# EAGLE design nanoIO-v2.2 (EAGLE 9.6.2)
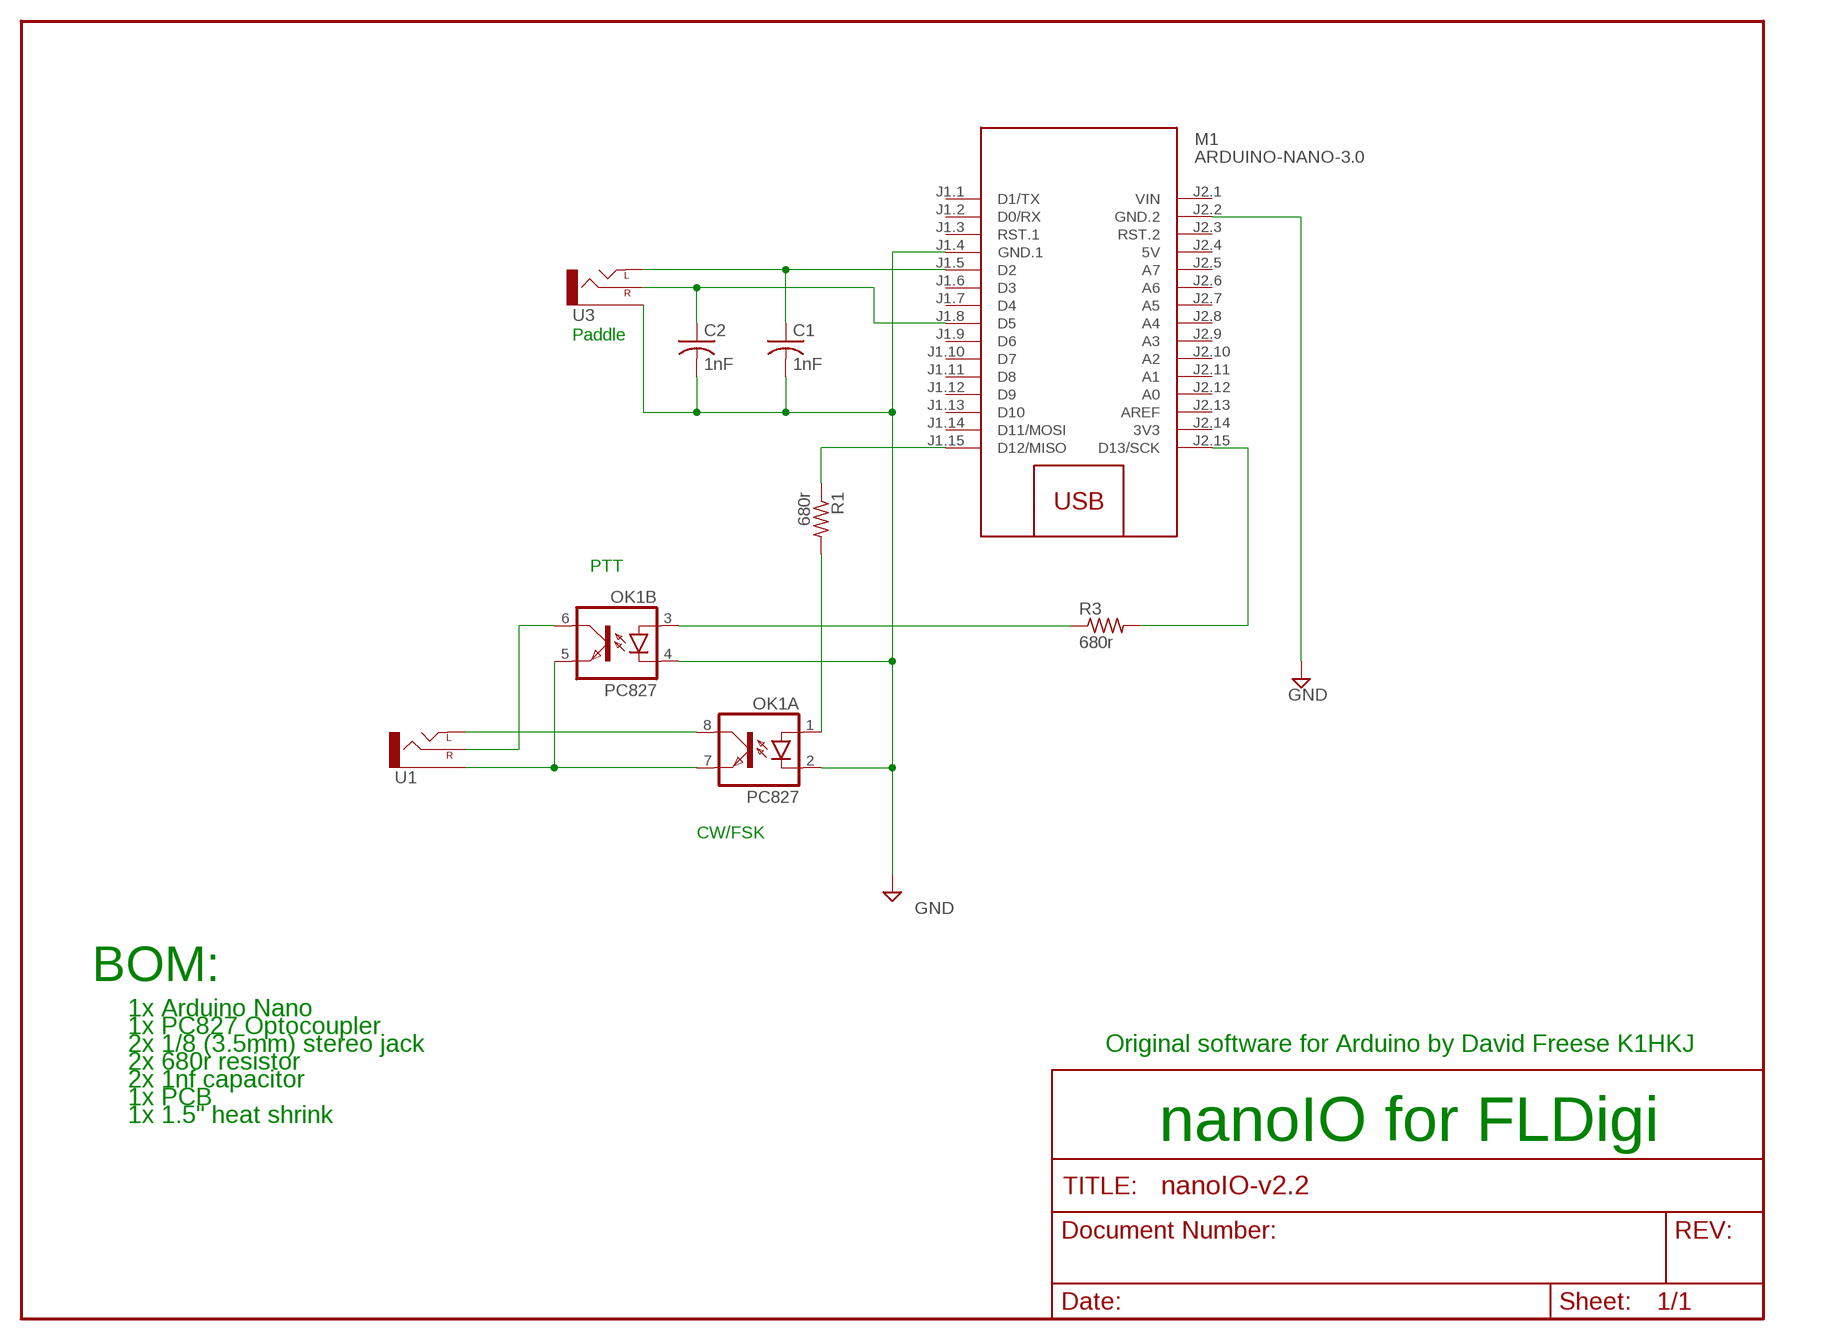
[diagram p0: schematic, sheet 1]

## Parts
C1  1nF  C-US025-025X050  [C025-025X050]
C2  1nF  C-US025-025X050  [C025-025X050]
M1  ARDUINO-NANO-3.0  [ARDUINO-NANO-3.0]
OK1  PC827  [DIL08]
R1  680r  R-US_0204/7  [0204/7]
R3  680r  R-US_0204/7  [0204/7]
U1  AUDIO-JACKPTH  [AUDIO-JACK]
U3  AUDIO-JACKPTH  [AUDIO-JACK]

## Nets
GND: C1.2 C2.2 M1.J1.4(GND.1) M1.J2.2(GND.2) OK1.2(A:C) OK1.4(B:C) U3.SLEEVE
N$1: C1.1 M1.J1.5(D2) U3.TIP(LEFT)
N$2: OK1.1(A:A) R1.2
N$3: C2.1 M1.J1.8(D5) U3.RING(RIGHT)
N$4: M1.J2.15(D13/SCK) R3.2
N$6: M1.J1.15(D12/MISO) R1.1
N$8: OK1.5(B:EMIT) OK1.7(A:EMIT) U1.SLEEVE
N$9: OK1.8(A:COL) U1.TIP(LEFT)
N$10: OK1.3(B:A) R3.1
N$11: OK1.6(B:COL) U1.RING(RIGHT)
Unconnected: M1.J1.1(D1/TX) M1.J1.2(D0/RX) M1.J1.3(RST.1) M1.J1.6(D3) M1.J1.7(D4) M1.J1.9(D6) M1.J1.10(D7) M1.J1.11(D8) M1.J1.12(D9) M1.J1.13(D10) M1.J1.14(D11/MOSI) M1.J2.3(RST.2) M1.J2.5(A7) M1.J2.6(A6) M1.J2.7(A5) M1.J2.8(A4) M1.J2.9(A3) M1.J2.10(A2) M1.J2.11(A1) M1.J2.12(A0) M1.J2.13(AREF)

## Notes on the sheet
- Paddle
- PTT
- CW/FSK
- BOM:
- 1x Arduino Nano
- 1x PC827 Optocoupler
- 2x 1/8 (3.5mm) stereo jack | Original software for Arduino by David Freese K1HKJ
- 2x 680r resistor
- 2x 1nf capacitor
- 1x PCB
- 1x 1.5" heat shrink
- nanoIO for FLDigi

## Power pins joined to a net without a drawn wire
3V3: M1.J2.14(3V3)
5V: M1.J2.4(5V)
VIN: M1.J2.1(VIN)

## Library data of the parts
C1 C2 = rcl:C-US: CAPACITOR, American symbol; SPICEPREFIX: C
M1 = diy-modules:ARDUINO-NANO-3.0: Arduino Nano 3.0 and compatible devices More details available here: https://www.arduino.cc/en/Main/ArduinoBoardNano Click here to find device on ebay.com <http://www.ebay.com/sch/arduino+nano>
OK1 = optocoupler:PC827: SHARP OPTO COUPLER; OC_FARNELL: unknown; OC_NEWARK: unknown
R1 R3 = rcl:R-US_: RESISTOR, American symbol; SPICEPREFIX: R
U1 U3 = SparkFun:AUDIO-JACK: 3.5mm Audio Jack Simple 3.5mm common PCB mount audio jack. SKU: PRT-08032

## Board
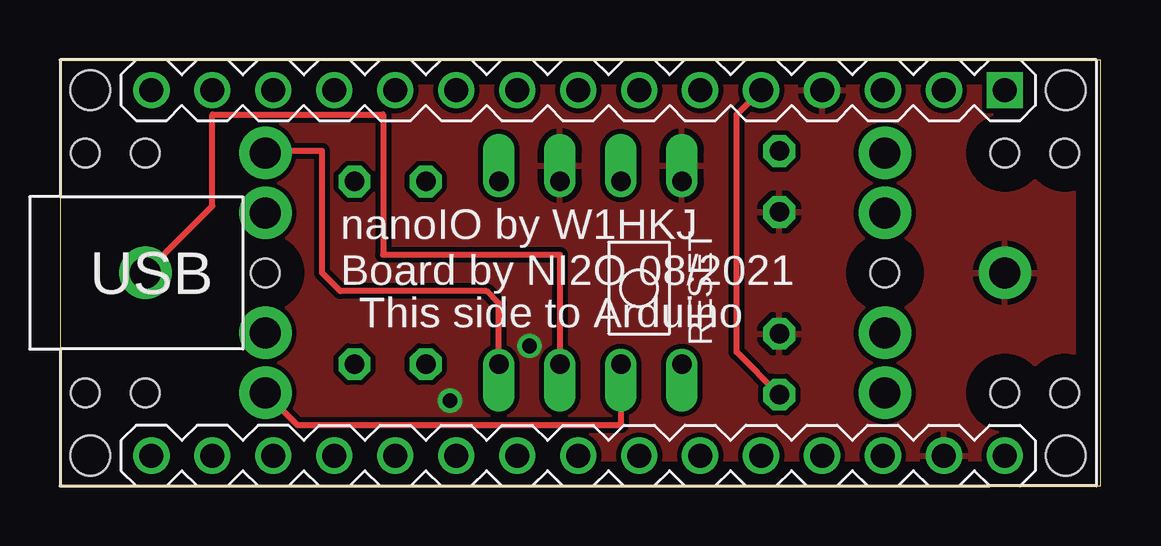
[diagram p1: board, top side]
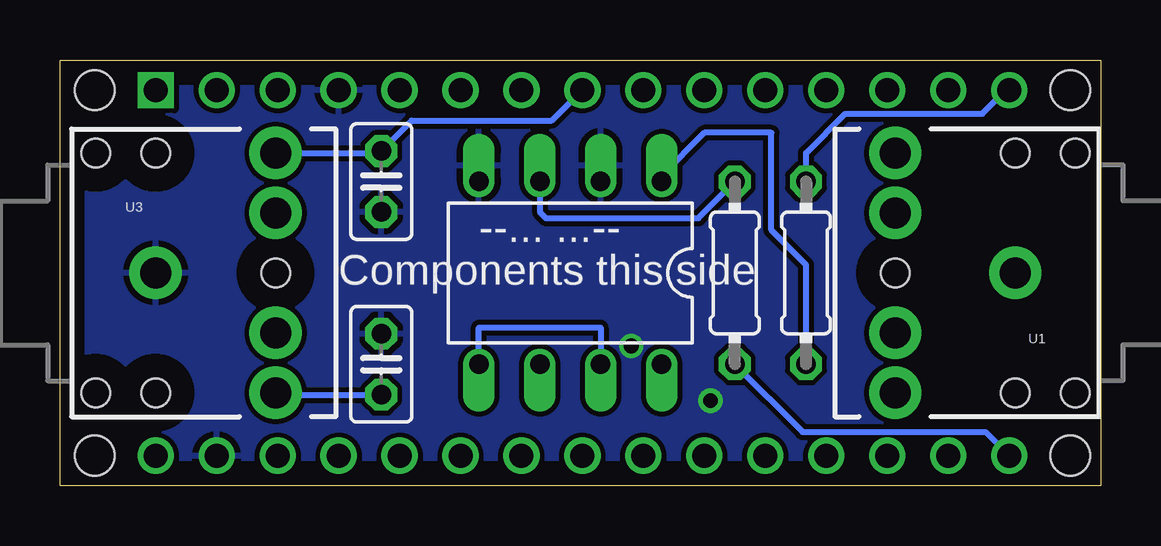
[diagram p2: board, bottom side, seen from below]

Size 43.36 x 17.77 mm. Coordinates in mm from the lower left corner, seen from the top.
Outline: 0,0 43.36,0 43.36,17.77 0,17.77 0,0
Copper layers (1*16): Top 0.035mm / dielectric 1.5mm / Bottom 0.035mm
Design rules "default": minimum track width 10mil, minimum drill 24mil, track to track 8mil, track to pad 8mil, pad to pad 8mil, via to via 8mil, smd to smd 8mil, copper to edge 40mil, drill to drill 8mil, minimum pad ring 10mil, minimum via ring 8mil, stop-mask expansion 4mil, vias tented up to drill 0mil, thermal gap 10mil

### Footprints (pad centres in the part's own frame; a part is rotated, then mirrored left to right if it is on the bottom)
C025-025X050 = drill 0.813 octagon: 1 -1.27,0; 2 1.27,0
ARDUINO-NANO-3.0 = drill 1 square: J1.1 17.78,7.62 | drill 1: J1.2 15.24,7.62; J1.3 12.7,7.62; J1.4 10.16,7.62; J1.5 7.62,7.62; J1.6 5.08,7.62; J1.7 2.54,7.62; J1.8 0,7.62; J1.9 -2.54,7.62; J1.10 -5.08,7.62; J1.11 -7.62,7.62; J1.12 -10.16,7.62; J1.13 -12.7,7.62; J1.14 -15.24,7.62; J1.15 -17.78,7.62; J2.1 17.78,-7.62; J2.2 15.24,-7.62; J2.3 12.7,-7.62; J2.4 10.16,-7.62; J2.5 7.62,-7.62; J2.6 5.08,-7.62; J2.7 2.54,-7.62; J2.8 0,-7.62; J2.9 -2.54,-7.62; J2.10 -5.08,-7.62; J2.11 -7.62,-7.62; J2.12 -10.16,-7.62; J2.13 -12.7,-7.62; J2.14 -15.24,-7.62; J2.15 -17.78,-7.62 | hole 1.651: -20.32,7.62; -20.32,-7.62; 20.32,-7.62; 20.32,7.62
DIL08 = drill 0.813 offset: 1 -3.81,-3.81; 2 -1.27,-3.81; 3 1.27,-3.81; 4 3.81,-3.81; 5 3.81,3.81; 6 1.27,3.81; 7 -1.27,3.81; 8 -3.81,3.81
0204/7 = drill 0.813 octagon: 1 -3.81,0; 2 3.81,0
AUDIO-JACK = drill 1.3 pad 2.184: RING 5,5; RSH 5,2.5; SLEEVE 0,0; TIP 5,-5; TSH 5,-2.5 | hole 1.2: 0,5; -2.5,5; -2.5,-5; 0,-5; 5,0

### Placement (x,y rotation side)
C1  29.97,5.08 90 bottom
C2  29.97,12.7 270 bottom
M1  21.59,8.89 0 top
OK1  22.1,8.89 180 bottom
R1  12.27,8.89 270 bottom
R3  15.24,8.89 270 bottom
U1  3.56,8.89 180 bottom
U3  39.37,8.89 0 bottom

### Tracks (layer width: path | path; a pad name or v marks a point on that pad's centre or on a via)
GND  (via drill 0.61)
  other vias: 16.26,3.56 19.56,5.84
  pour Top: 0,0 0,17.78 43.18,17.78 43.18,0
  pour Bottom: 0,0 0,17.78 43.18,17.78 43.18,0
N$1
  Top 0.254: C1.1 28.19,5.59 28.19,15.49 M1.J1.5
  Bottom 0.254: U3.TIP 34.29,3.81 C1.1
N$2
  Bottom 0.254: R1.2 12.27,9.22 13.72,10.67 13.72,14.73 16.51,14.73 18.29,12.95 OK1.1
N$3
  Bottom 0.254: U3.RING 30.05,13.89 C2.1 28.7,15.24 22.86,15.24 M1.J1.8
N$4
  Bottom 0.254: R3.2 12.41,2.25 4.79,2.25 M1.J2.15
N$6
  Bottom 0.254: R1.1 12.27,13.89 10.64,15.53 4.93,15.53 3.94,16.51 M1.J1.15
N$8
  Top 0.254: U1.SLEEVE 6.35,11.68 6.35,15.49 13.46,15.49 13.46,9.65 20.83,9.65 OK1.7
  Bottom 0.254: OK1.5 25.91,6.6 20.83,6.6 OK1.7
N$9
  Top 0.254: OK1.8 18.29,7.62 17.78,8.13 11.68,8.13 10.92,8.89 10.92,13.97 8.64,13.97 U1.TIP
N$10
  Bottom 0.254: OK1.3 23.37,11.43 23.11,11.18 16.76,11.18 R3.1
N$11
  Top 0.254: OK1.6 23.37,2.54 9.91,2.54 U1.RING

### Text on the board
tPlace: This side to Arduino
tNames: nanoIO by W1HKJ / Board by NI2O 08/2021
bNames: --... ...-- | Components this side